# EAGLE design Vibration Sensor Schematic Rev1 (EAGLE 9.6.2)
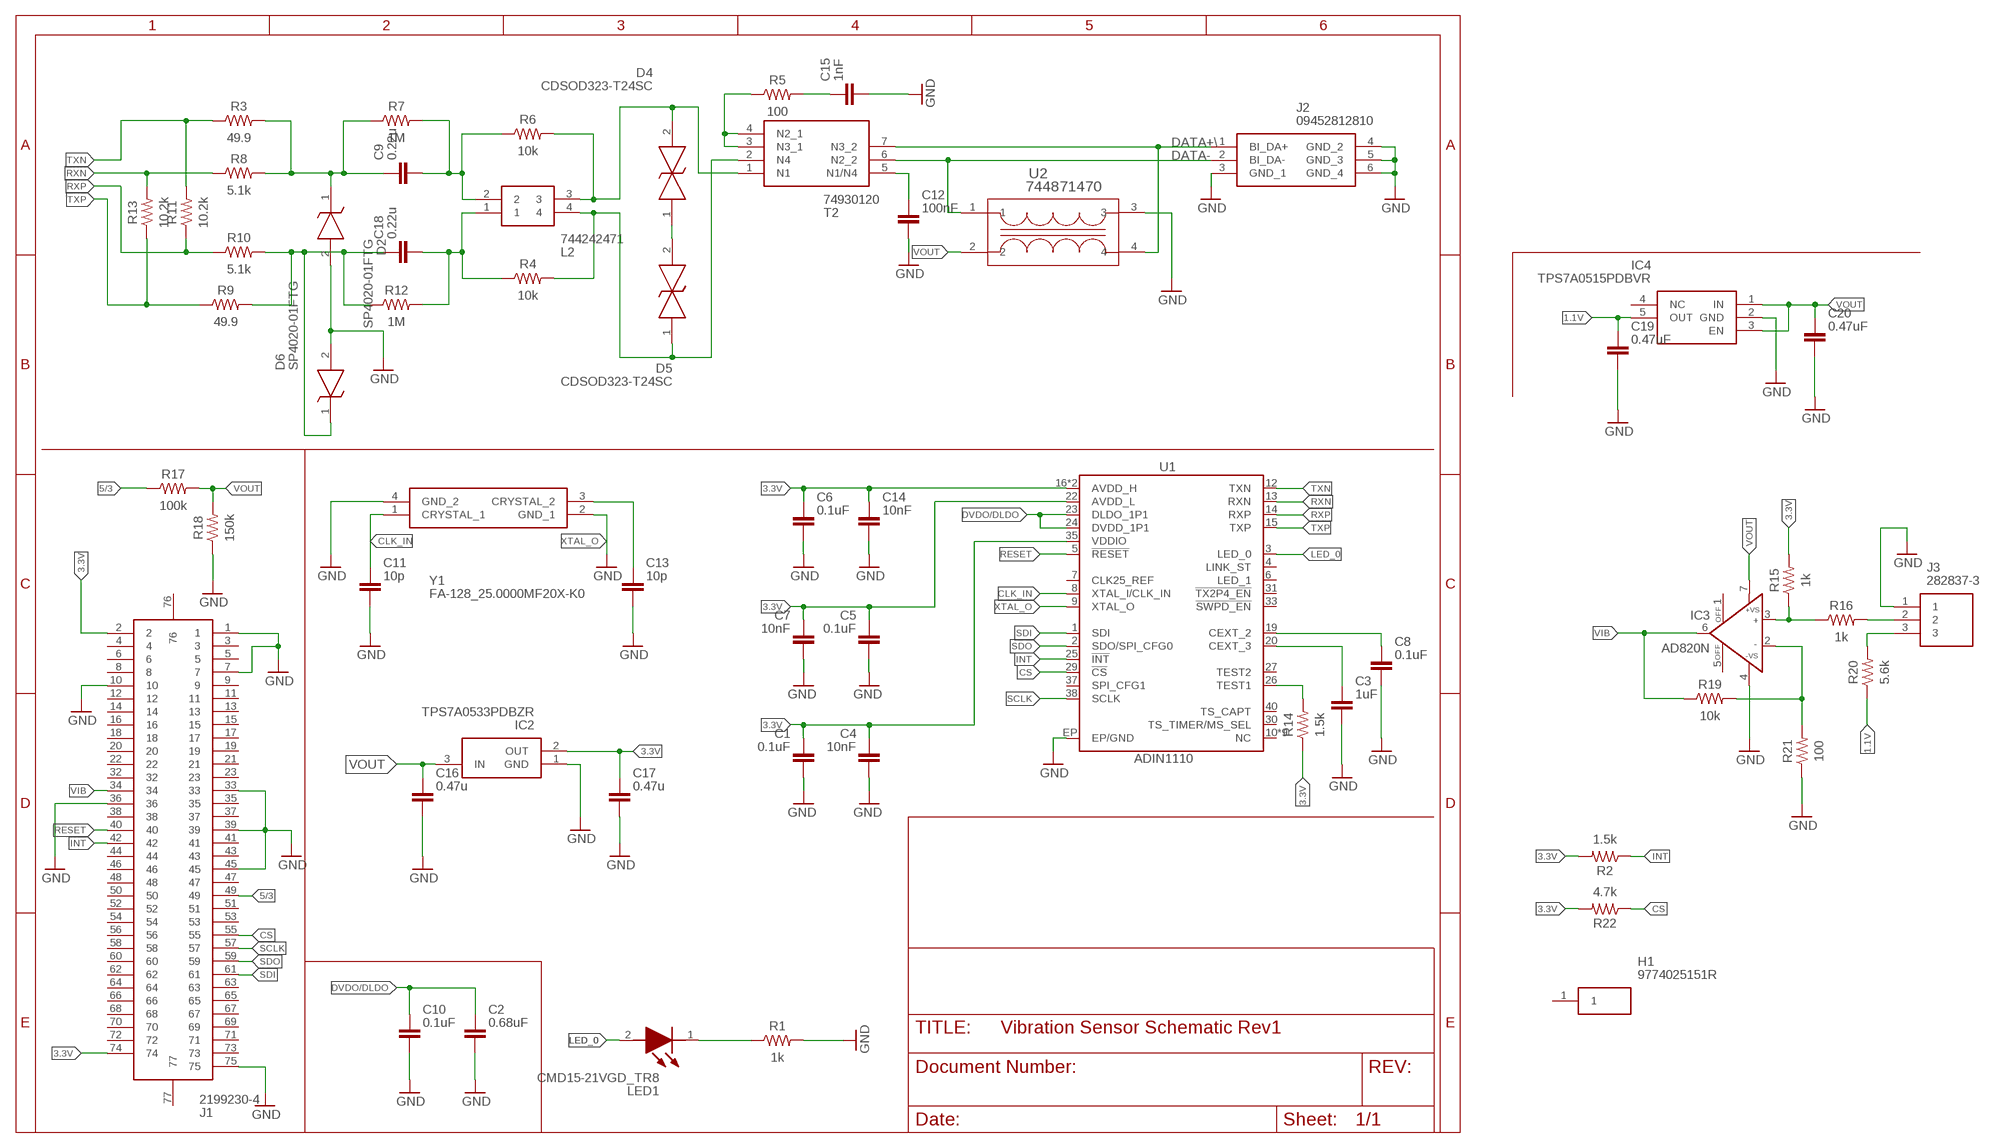
[diagram p0: schematic, sheet 1]

## Parts
C1  0.1uF  C_CHIP-0402(1005-METRIC)  [CAPC1005X60]
C2  0.68uF  C_CHIP-0402(1005-METRIC)  [CAPC1005X60]
C3  1uF  C_CHIP-0402(1005-METRIC)  [CAPC1005X60]
C4  10nF  C_CHIP-0402(1005-METRIC)  [CAPC1005X60]
C5  0.1uF  C_CHIP-0402(1005-METRIC)  [CAPC1005X60]
C6  0.1uF  C_CHIP-0402(1005-METRIC)  [CAPC1005X60]
C7  10nF  C_CHIP-0402(1005-METRIC)  [CAPC1005X60]
C8  0.1uF  C_CHIP-0402(1005-METRIC)  [CAPC1005X60]
C9  0.22u  C_CHIP-0402(1005-METRIC)  [CAPC1005X60]
C10  0.1uF  C_CHIP-0402(1005-METRIC)  [CAPC1005X60]
C11  10p  C_CHIP-0402(1005-METRIC)  [CAPC1005X60]
C12  100nF  C_CHIP-0402(1005-METRIC)  [CAPC1005X60]
C13  10p  C_CHIP-0402(1005-METRIC)  [CAPC1005X60]
C14  10nF  C_CHIP-0402(1005-METRIC)  [CAPC1005X60]
C15  1nF  C_CHIP-0402(1005-METRIC)  [CAPC1005X60]
C16  0.47u  C_CHIP-0402(1005-METRIC)  [CAPC1005X60]
C17  0.47u  C_CHIP-0402(1005-METRIC)  [CAPC1005X60]
C18  0.22u  C_CHIP-0402(1005-METRIC)  [CAPC1005X60]
C19  0.47uF  C_CHIP-0402(1005-METRIC)  [CAPC1005X60]
C20  0.47uF  C_CHIP-0402(1005-METRIC)  [CAPC1005X60]
D2  SP4020-01FTG  [SOD2613X114N]
D4  CDSOD323-T24SC  [SOD2513X114N]
D5  CDSOD323-T24SC  [SOD2513X114N]
D6  SP4020-01FTG  [SOD2613X114N]
H1  9774025151R  [9774025151R]
IC2  TPS7A0533PDBZR  [SOT95P237X112-3N]
IC3  AD820N  [DIL08]
IC4  TPS7A0515PDBVR  [SOT95P280X145-5N]
J1  2199230-4  [21992304]
J2  09452812810  [09452812810]
J3  282837-3  [2828373]
L2  744242471  [744242471]
LED1  CMD15-21VGD_TR8  [LEDC3215X130N]
R1  1k  R-US_CHIP-0402(1005-METRIC)  [RESC1005X40]
R2  1.5k  R-US_CHIP-0402(1005-METRIC)  [RESC1005X40]
R3  49.9  R-US_CHIP-0402(1005-METRIC)  [RESC1005X40]
R4  10k  R-US_CHIP-0402(1005-METRIC)  [RESC1005X40]
R5  100  R-US_CHIP-0402(1005-METRIC)  [RESC1005X40]
R6  10k  R-US_CHIP-0402(1005-METRIC)  [RESC1005X40]
R7  1M  R-US_CHIP-0402(1005-METRIC)  [RESC1005X40]
R8  5.1k  R-US_CHIP-0402(1005-METRIC)  [RESC1005X40]
R9  49.9  R-US_CHIP-0402(1005-METRIC)  [RESC1005X40]
R10  5.1k  R-US_CHIP-0402(1005-METRIC)  [RESC1005X40]
R11  10.2k  R-US_CHIP-0402(1005-METRIC)  [RESC1005X40]
R12  1M  R-US_CHIP-0402(1005-METRIC)  [RESC1005X40]
R13  10.2k  R-US_CHIP-0402(1005-METRIC)  [RESC1005X40]
R14  1.5k  R-US_CHIP-0402(1005-METRIC)  [RESC1005X40]
R15  1k  R-US_CHIP-0402(1005-METRIC)  [RESC1005X40]
R16  1k  R-US_CHIP-0402(1005-METRIC)  [RESC1005X40]
R17  100k  R-US_CHIP-0402(1005-METRIC)  [RESC1005X40]
R18  150k  R-US_CHIP-0402(1005-METRIC)  [RESC1005X40]
R19  10k  R-US_CHIP-0402(1005-METRIC)  [RESC1005X40]
R20  5.6k  R-US_CHIP-0402(1005-METRIC)  [RESC1005X40]
R21  100  R-US_CHIP-0402(1005-METRIC)  [RESC1005X40]
R22  4.7k  R-US_CHIP-0402(1005-METRIC)  [RESC1005X40]
T2  74930120  [74930120]
U1  ADIN1110  [LFCSP-40]
U2  744871470  [SMT_871470_WRE]
Y1  FA-128_25.0000MF20X-K0  [FA128250000MF20XK0]

## Nets
1.1V: C19.1 IC4.5(OUT) R20.1
3.3V: C1.1 C4.1 C5.1 C6.1 C7.1 C14.1 C17.1 IC2.2(OUT) J1.2 J1.74 R2.2 R14.1 R15.2 R22.2 U1.16(AVDD_H) U1.17(AVDD_H) U1.22(AVDD_L) U1.35(VDDIO)
5/3: J1.49 R17.1
CLK_IN: C11.1 U1.8(XTAL_I/CLK_IN) Y1.1(CRYSTAL_1)
CS: J1.55 R22.1 U1.29(!CS!)
DATA+\: J2.1(BI_DA+) T2.7(N3_2) U2.4
DATA-: J2.2(BI_DA-) T2.6(N2_2) U2.1
DVDO/DLDO: C2.1 C10.1 U1.23(DLDO_1P1) U1.24(DVDD_1P1)
GND: C1.2 C2.2 C3.2 C4.2 C5.2 C6.2 C7.2 C8.2 C10.2 C11.2 C12.2 C13.2 C14.2 C15.2 C16.2 C17.2 C19.2 C20.2 D2.2(A) D6.2(A) IC2.1(GND) IC3.4(-VS) IC4.2(GND) J1.1 J1.7 J1.10 J1.33 J1.36 J1.39 J1.45 J1.75 J2.3(GND_1) J2.4(GND_2) J2.5(GND_3) J2.6(GND_4) J3.1 R1.2 R18.1 R21.1 U1.EP(EP/GND) U2.3 Y1.2(GND_1) Y1.4(GND_2)
INT: J1.42 R2.1 U1.25(!INT!)
LED_0: LED1.2(A) U1.3(LED_0)
N$1: C15.1 R5.2
N$2: LED1.1(K) R1.1
N$3: IC3.3(IN+) R15.1 R16.1
N$4: IC3.2(IN-) R19.2 R21.2
N$5: J3.3 R20.2
N$6: J3.2 R16.2
N$16: C18.2 L2.1 R4.1 R12.2
N$18: R14.2 U1.26(TEST1)
N$19: C9.2 L2.2 R6.1 R7.2
N$20: D5.1 L2.4 R4.2 T2.2(N4)
N$21: C8.1 U1.19(CEXT_2)
N$22: C3.1 U1.20(CEXT_3)
N$24: C9.1 D2.1(K) R3.2 R7.1 R8.2
N$28: C12.1 T2.5(N1/N4)
N$30: R5.1 T2.3(N3_1) T2.4(N2_1)
N$31: C18.1 D6.1(K) R9.2 R10.2 R12.1
N$42: D4.2 L2.3 R6.2 T2.1(N1)
N$43: D4.1 D5.2
RESET: J1.40 U1.5(!RESET!)
RXN: R8.1 R13.2 U1.13(RXN)
RXP: R10.1 R11.1 U1.14(RXP)
SCLK: J1.57 U1.38(SCLK)
SDI: J1.61 U1.1(SDI)
SDO: J1.59 U1.2(SDO/SPI_CFG0)
TXN: R3.1 R11.2 U1.12(TXN)
TXP: R9.1 R13.1 U1.15(TXP)
VIB: IC3.6(OUT) J1.34 R19.1
VOUT: C16.1 C20.1 IC2.3(IN) IC3.7(+VS) IC4.1(IN) IC4.3(EN) R17.2 R18.2 U2.2
XTAL_O: C13.1 U1.9(XTAL_O) Y1.3(CRYSTAL_2)
Unconnected: H1.1 IC3.1(OFF) IC3.5(OFF) IC4.4(NC) J1.3 J1.4 J1.5 J1.6 J1.8 J1.9 J1.11 J1.12 J1.13 J1.14 J1.15 J1.16 J1.17 J1.18 J1.19 J1.20 J1.21 J1.22 J1.23 J1.32 J1.35 J1.37 J1.38 J1.41 J1.43 J1.44 J1.46 J1.47 J1.48 J1.50 J1.51 J1.52 J1.53 J1.54 J1.56 J1.58 J1.60 J1.62 J1.63 J1.64 J1.65 J1.66 J1.67 J1.68 J1.69 J1.70 J1.71 J1.72 J1.73 J1.76 J1.77 U1.4(LINK_ST) U1.6(LED_1) U1.7(CLK25_REF) U1.10(NC) U1.11(NC) U1.18(NC) U1.21(NC) U1.27(TEST2) U1.28(NC) U1.30(TS_TIMER/MS_SEL) U1.31(!TX2P4_EN!) U1.32(NC) U1.33(!SWPD_EN!) U1.34(NC) U1.36(NC) U1.37(SPI_CFG1) U1.39(NC) U1.40(TS_CAPT)

## Library data of the parts
C1-C20 = Capacitor:C: Capacitor - Generic; CATEGORY: Capacitor
D2 D6 = SamacSys_Parts:SP4020-01FTG: Littelfuse TVS Diode Array Uni-Directional, 750W Triple, 2-Pin SOD-323 SP4020-01FTG, Source: Datasheet <https://www.littelfuse.com/~/media/electronics/datasheets/tvs_diode_arrays/littelfuse_tvs_diode_array_sp4020_datasheet.pdf.pdf>; DESCRIPTION: Littelfuse TVS Diode Array Uni-Directional, 750W Triple, 2-Pin SOD-323 SP4020-01FTG,; HEIGHT: 1.14mm; MANUFACTURER_NAME: LITTELFUSE; MANUFACTURER_PART_NUMBER: SP4020-01FTG; MOUSER_PART_NUMBER: 576-SP4020-01FTG; MOUSER_PRICE-STOCK: https://www.mouser.co.uk/ProductDetail/Littelfuse/SP4020-01FTG?qs=eIdvKxokjW4Yi6Ov7kZjPg%3D%3D
D4 D5 = SamacSys_Parts:CDSOD323-T24SC: ESD Suppressors / TVS Diodes Bidirectional Std Cap Source: Datasheet <https://www.bourns.com/docs/Product-Datasheets/CDSOD323-TxxLC.pdf>; ARROW_PART_NUMBER: CDSOD323-T24SC; ARROW_PRICE-STOCK: https://www.arrow.com/en/products/cdsod323-t24sc/bourns?region=nac; DESCRIPTION: ESD Suppressors / TVS Diodes Bidirectional Std Cap; HEIGHT: 1.14mm; MANUFACTURER_NAME: Bourns; MANUFACTURER_PART_NUMBER: CDSOD323-T24SC; MOUSER_PART_NUMBER: 652-CDSOD323-T24SC; MOUSER_PRICE-STOCK: https://www.mouser.co.uk/ProductDetail/Bourns/CDSOD323-T24SC?qs=6S5Watp5UnLXKCNVDRqkmw%3D%3D
H1 = 9774025151R:9774025151R: 9774025151R, 2.5mm High Steel Round Spacer With 5.1mm Diameter and 3.5mm Bore Diameter for M2.5 Screw Source: Datasheet <https://componentsearchengine.com/Datasheets/2/9774025151R.pdf>; DESCRIPTION: 9774025151R, 2.5mm High Steel Round Spacer With 5.1mm Diameter and 3.5mm Bore Diameter for M2.5 Screw; HEIGHT: 3.9mm; MANUFACTURER_NAME: Wurth Elektronik; MANUFACTURER_PART_NUMBER: 9774025151R; MOUSER_PART_NUMBER: 710-9774025151R; MOUSER_PRICE-STOCK: https://www.mouser.co.uk/ProductDetail/Wurth-Elektronik/9774025151R?qs=KRpiEsko4Hn1l7MecUfDpA%3D%3D
IC2 = SamacSys_Parts:TPS7A0533PDBZR: 1-A, ultra-low-IQ, 200-mA low-dropout (LDO) regulator in a small-sized package Source: Datasheet <https://www.ti.com/lit/gpn/TPS7A05>; DESCRIPTION: 1-A, ultra-low-IQ, 200-mA low-dropout (LDO) regulator in a small-sized package; HEIGHT: 1.12mm; MANUFACTURER_NAME: Texas Instruments; MANUFACTURER_PART_NUMBER: TPS7A0533PDBZR; MOUSER_PART_NUMBER: 595-TPS7A0533PDBZR; MOUSER_PRICE-STOCK: https://www.mouser.co.uk/ProductDetail/Texas-Instruments/TPS7A0533PDBZR?qs=XeJtXLiO41SvDtfTV1kb9A%3D%3D
IC3 = analog-devices:AD820N: Single-Supply, Rail-to-Rail, Low Power, FET Input Op Amp Source: http://www.analog.com/static/imported-files/data_sheets/AD820.pdf; OC_FARNELL: 1438579; OC_NEWARK: unknown
IC4 = SamacSys_Parts:TPS7A0515PDBVR: 1-A, ultra-low-IQ, 200-mA low-dropout (LDO) regulator in a small-sized package Source: Datasheet <http://www.ti.com/lit/gpn/tps7a05>; ARROW_PART_NUMBER: TPS7A0515PDBVR; ARROW_PRICE-STOCK: https://www.arrow.com/en/products/tps7a0515pdbvr/texas-instruments; DESCRIPTION: 1-A, ultra-low-IQ, 200-mA low-dropout (LDO) regulator in a small-sized package; HEIGHT: 1.45mm; MANUFACTURER_NAME: Texas Instruments; MANUFACTURER_PART_NUMBER: TPS7A0515PDBVR; MOUSER_PART_NUMBER: 595-TPS7A0515PDBVR; MOUSER_PRICE-STOCK: https://www.mouser.co.uk/ProductDetail/Texas-Instruments/TPS7A0515PDBVR?qs=vdi0iO8H4N3Aseh6c469Zw%3D%3D
J1 = SamacSys_Parts:2199230-4: AMP - TE CONNECTIVITY - 2199230-4 - CONNECTOR, CARD EDGE, RCPT, 67POS, 2ROW Source: Datasheet <https://www.te.com/commerce/DocumentDelivery/DDEController?Action=srchrtrv&DocNm=2199230&DocType=Customer Drawing&DocLang=English&DocFormat=pdf&PartCntxt=2199230-4>; DESCRIPTION: AMP - TE CONNECTIVITY - 2199230-4 - CONNECTOR, CARD EDGE, RCPT, 67POS, 2ROW; HEIGHT: mm; MANUFACTURER_NAME: TE Connectivity; MANUFACTURER_PART_NUMBER: 2199230-4; MOUSER_PART_NUMBER: 571-2199230-4; MOUSER_PRICE-STOCK: https://www.mouser.co.uk/ProductDetail/TE-Connectivity/2199230-4?qs=EQCnRgr4b6HnhitEoflgGQ%3D%3D
J2 = SamacSys_Parts:09452812810: T1 Industrial Jack Connectors, PCB connector, Angled, THR connection, Rated current: 4 A, Contacts: 2, + shielding Source: Datasheet <https://b2b.harting.com/files/download/PRD/PDF_TS/09452812810_100689697DRW003M.pdf?siteName=Ebusiness Site&autoLogoutEnabled=false&autoLogoutTime=0&contextURL=https://b2b.harting.com/ebusiness/en&maintenanceAnnouncement={ }&showPrivacyEmailA>; DESCRIPTION: T1 Industrial Jack Connectors, PCB connector, Angled, THR connection, Rated current: 4 A, Contacts: 2, + shielding; HEIGHT: 6.1mm; MANUFACTURER_NAME: HARTING; MANUFACTURER_PART_NUMBER: 09452812810; MOUSER_PART_NUMBER: 617-09452812810; MOUSER_PRICE-STOCK: https://www.mouser.co.uk/ProductDetail/HARTING/09452812810?qs=IPgv5n7u5QYWjjwXDCl9%252Bw%3D%3D
J3 = SamacSys_Parts:282837-3: Fixed Terminal Blocks 5.08MM PCB MOUNT 3P Source: Datasheet <http://uk.rs-online.com/web/p/products/7100371P>; ARROW_PART_NUMBER: 282837-3; ARROW_PRICE-STOCK: https://www.arrow.com/en/products/282837-3/te-connectivity?region=nac; DESCRIPTION: Fixed Terminal Blocks 5.08MM PCB MOUNT 3P; HEIGHT: 10.3mm; MANUFACTURER_NAME: TE Connectivity; MANUFACTURER_PART_NUMBER: 282837-3; MOUSER_PART_NUMBER: 571-2828373; MOUSER_PRICE-STOCK: https://www.mouser.co.uk/ProductDetail/TE-Connectivity/282837-3?qs=A%252Bip%252BNCYi6PMRxtBYEOSrQ%3D%3D
L2 = SamacSys_Parts:744242471: WE-SLM SMD Common Mode Choke 470uH 400mA Source: Datasheet <http://katalog.we-online.com/pbs/datasheet/744242471.pdf>; DESCRIPTION: WE-SLM SMD Common Mode Choke 470uH 400mA; HEIGHT: 3mm; MANUFACTURER_NAME: Wurth Elektronik; MANUFACTURER_PART_NUMBER: 744242471; MOUSER_PART_NUMBER: 710-744242471; MOUSER_PRICE-STOCK: https://www.mouser.co.uk/ProductDetail/Wurth-Elektronik/744242471?qs=PGXP4M47uW7UIiGXUC0ZiA%3D%3D
LED1 = SamacSys_Parts:CMD15-21VGD_TR8: VCC CMD15-21VGD/TR8, CMD15-21 Series Clear LED, 570 nm,, Rectangle Lens Source: Datasheet <https://componentsearchengine.com/Datasheets/2/CMD15-21VGD_TR8.pdf>; ARROW_PART_NUMBER: CMD15-21VGD/TR8; ARROW_PRICE-STOCK: https://www.arrow.com/en/products/cmd15-21vgdtr8/visual-communications; DESCRIPTION: VCC CMD15-21VGD/TR8, CMD15-21 Series Clear LED, 570 nm,, Rectangle Lens; HEIGHT: 1.3mm; MANUFACTURER_NAME: Visual Communications Company; MANUFACTURER_PART_NUMBER: CMD15-21VGD/TR8; MOUSER_PART_NUMBER: 606-CMD15-21VGD/TR8; MOUSER_PRICE-STOCK: https://www.mouser.co.uk/ProductDetail/VCC/CMD15-21VGD-TR8?qs=rmKzSijf6EYPDoIZjcp6ew%3D%3D
R1-R22 = Resistor:R-US: Resistor Fixed - ANSI; CATEGORY: Resistor; SUB-CATEGORY: Fixed
T2 = SamacSys_Parts:74930120: WURTH ELEKTRONIK - 74930120 - Transformer, Ethernet, 1P, 10/100/1000/10G Base-T, PoE+, 1:1, Surface Mount Source: Datasheet <https://www.we-online.com/catalog/datasheet/74930120.pdf>; DESCRIPTION: WURTH ELEKTRONIK - 74930120 - Transformer, Ethernet, 1P, 10/100/1000/10G Base-T, PoE+, 1:1, Surface Mount; HEIGHT: 2.9mm; MANUFACTURER_NAME: Wurth Elektronik; MANUFACTURER_PART_NUMBER: 74930120; MOUSER_PART_NUMBER: 710-74930120; MOUSER_PRICE-STOCK: https://www.mouser.co.uk/ProductDetail/Wurth-Elektronik/74930120?qs=zW32dvEIR3sEJWqR2tCkqQ%3D%3D
U1 = ADIN1110:ADIN1110: The ADIN1110 is an ultra low power, single port, 10BASE-T1L transceiver design for industrial Ethernet applications and is compliant with the IEEE® 802.3cg-2019™ Ethernet standard for long reach, 10 Mbps single pair Ethernet (SPE).; PROD_ID: IC-16335
U2 = 744871470:744871470; COPYRIGHT: Copyright (C) 2023 Ultra Librarian. All rights reserved.; MANUFACTURER_PART_NUMBER: 744871470; MFR_NAME: Wurth Electronics
Y1 = SamacSys_Parts:FA-128_25.0000MF20X-K0: Crystals 25MHz 10PPM -40C +85C 10pF Source: Datasheet <https://support.epson.biz/td/api/doc_check.php?dl=brief_FA-128&lang=en>; DESCRIPTION: Crystals 25MHz 10PPM -40C +85C 10pF; HEIGHT: 0.5mm; MANUFACTURER_NAME: Epson Timing; MANUFACTURER_PART_NUMBER: FA-128 25.0000MF20X-K0; MOUSER_PART_NUMBER: 732-FA-12825F20X-K0; MOUSER_PRICE-STOCK: https://www.mouser.co.uk/ProductDetail/Epson-Timing/FA-128-250000MF20X-K0?qs=csoGsJbXmtBBrE23v3bRHg%3D%3D

## Board
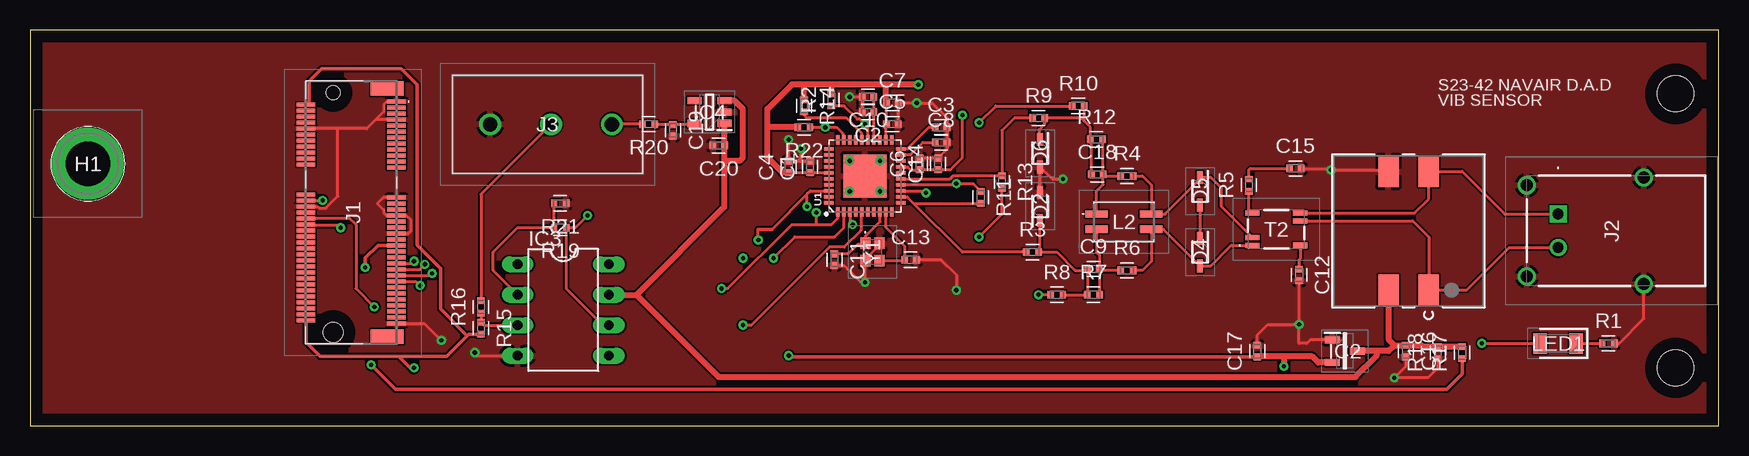
[diagram p1: board, top side]
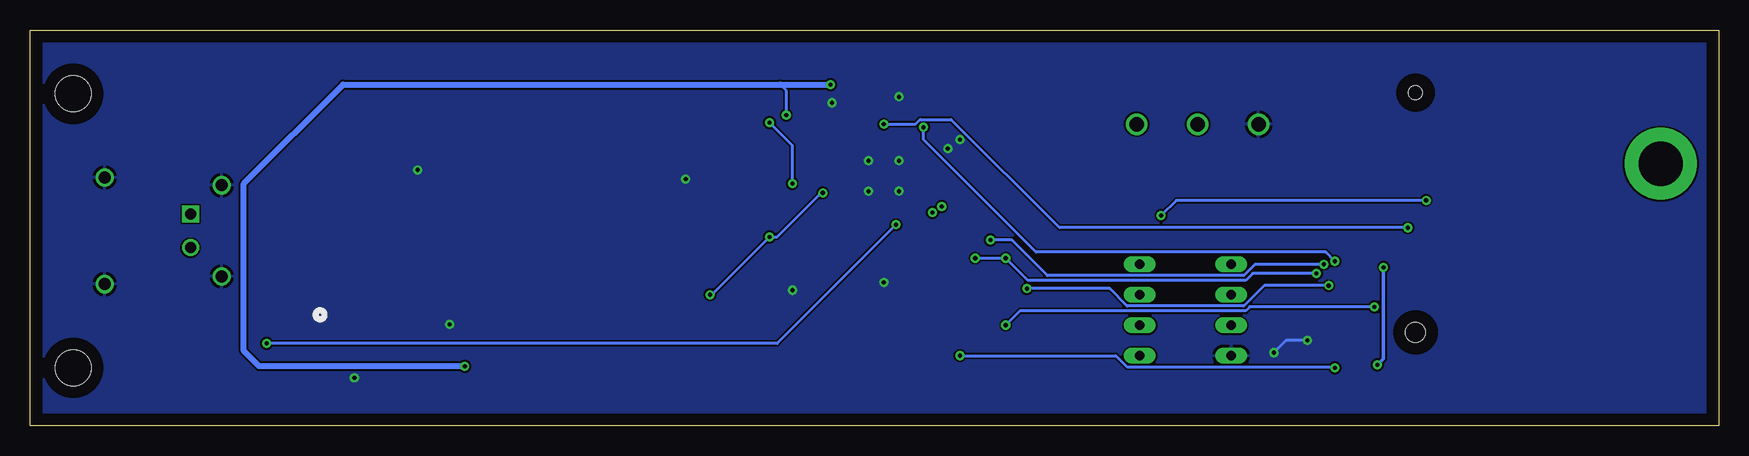
[diagram p2: board, bottom side, seen from below]

Size 140.77 x 33.01 mm. Coordinates in mm from the lower left corner, seen from the top.
Outline: 0,0 140.77,0 140.77,33.01 0,33.01 0,0
Copper layers (1*16): Top 0.035mm / dielectric 1.5mm / Bottom 0.035mm
Design rules "default": minimum track width 6mil, minimum drill 0.35mm, track to track 6mil, track to pad 6mil, pad to pad 6mil, via to via 6mil, smd to smd 6mil, copper to edge 40mil, drill to drill 6mil, minimum pad ring 10mil, minimum via ring 8mil, stop-mask expansion 4mil, vias tented up to drill 0mil, thermal gap 10mil
Holes 3 mm at 137.16,27.69 137.16,4.83

### Footprints (pad centres in the part's own frame; a part is rotated, then mirrored left to right if it is on the bottom)
CAPC1005X60 = smd 0.56 x 0.629: 1 -0.485,0; 2 0.485,0
SOD2613X114N = smd 1.075 x 0.5: 1 -1.15,0; 2 1.15,0
SOD2513X114N = smd 1.075 x 0.5: 1 -1.15,0; 2 1.15,0
9774025151R = drill 3.7 pad 6: 1 0,0
SOT95P237X112-3N = smd 1.25 x 0.6: 1 -1.05,0.95; 2 -1.05,-0.95; 3 1.05,0
DIL08 = drill 0.813 long: 1 -3.81,-3.81; 2 -1.27,-3.81; 3 1.27,-3.81; 4 3.81,-3.81; 5 3.81,3.81; 6 1.27,3.81; 7 -1.27,3.81; 8 -3.81,3.81
SOT95P280X145-5N = smd 1.2 x 0.6: 1 -1.25,0.95; 2 -1.25,0; 3 -1.25,-0.95; 4 1.25,-0.95; 5 1.25,0.95
21992304 = smd 0.3 x 1.55: 1 -9.25,3.625; 2 -9,-3.925; 3 -8.75,3.625; 4 -8.5,-3.925; 5 -8.25,3.625; 6 -8,-3.925; 7 -7.75,3.625; 8 -7.5,-3.925; 9 -7.25,3.625; 10 -7,-3.925; 11 -6.75,3.625; 12 -6.5,-3.925; 13 -6.25,3.625; 14 -6,-3.925; 15 -5.75,3.625; 16 -5.5,-3.925; 17 -5.25,3.625; 18 -5,-3.925; 19 -4.75,3.625; 20 -4.5,-3.925; 21 -4.25,3.625; 22 -4,-3.925; 23 -3.75,3.625; 32 -1.5,-3.925; 33 -1.25,3.625; 34 -1,-3.925; 35 -0.75,3.625; 36 -0.5,-3.925; 37 -0.25,3.625; 38 0,-3.925; 39 0.25,3.625; 40 0.5,-3.925; 41 0.75,3.625; 42 1,-3.925; 43 1.25,3.625; 44 1.5,-3.925; 45 1.75,3.625; 46 2,-3.925; 47 2.25,3.625; 48 2.5,-3.925; 49 2.75,3.625; 50 3,-3.925; 51 3.25,3.625; 52 3.5,-3.925; 53 3.75,3.625; 54 4,-3.925; 55 4.25,3.625; 56 4.5,-3.925; 57 4.75,3.625; 58 5,-3.925; 59 5.25,3.625; 60 5.5,-3.925; 61 5.75,3.625; 62 6,-3.925; 63 6.25,3.625; 64 6.5,-3.925; 65 6.75,3.625; 66 7,-3.925; 67 7.25,3.625; 68 7.5,-3.925; 69 7.75,3.625; 70 8,-3.925; 71 8.25,3.625; 72 8.5,-3.925; 73 8.75,3.625; 74 9,-3.925; 75 9.25,3.625 | smd 1.2 x 2.75: 76 -10.35,2.85; 77 10.35,2.85 | hole 1.15: -10,-1.65 | hole 1.65: 10,-1.65
09452812810 = drill 0.9 pad 1.4 square: 1 0,0 | drill 0.9 pad 1.4: 2 -2.8,0 | drill 1 pad 1.5: 3 -5.2,2.6; 4 2.4,2.6; 5 -5.85,-7.15; 6 3.05,-7.15
2828373 = drill 1.2 pad 1.8: 1 0,0; 2 5.08,0; 3 10.16,0
744242471 = smd 1.85 x 0.6: 1 -2.275,0.635; 2 -2.275,-0.635; 3 2.275,-0.635; 4 2.275,0.635
LEDC3215X130N = smd 1.15 x 1.7: 1 -1.5,0; 2 1.5,0
RESC1005X40 = smd 0.535 x 0.644: 1 -0.507,0; 2 0.507,0
74930120 = smd 1.2 x 0.41: 1 -1.99,-1.35; 2 -1.99,-0.7; 6 1.99,0.7; 7 1.99,1.35 | smd 0.6 x 0.41: 3 -2.29,1.35; 4 -1.69,1.35 | smd 1.2 x 0.5: 5 1.99,-1.35
LFCSP-40 = smd 0.8 x 0.285: 1 -3,2.25; 2 -3,1.75; 3 -3,1.25; 4 -3,0.75; 5 -3,0.25; 6 -3,-0.25; 7 -3,-0.75; 8 -3,-1.25; 9 -3,-1.75; 10 -3,-2.25; 21 3,-2.25; 22 3,-1.75; 23 3,-1.25; 24 3,-0.75; 25 3,-0.25; 26 3,0.25; 27 3,0.75; 28 3,1.25; 29 3,1.75; 30 3,2.25 | smd 0.285 x 0.8: 11 -2.25,-3; 12 -1.75,-3; 13 -1.25,-3; 14 -0.75,-3; 15 -0.25,-3; 16 0.25,-3; 17 0.75,-3; 18 1.25,-3; 19 1.75,-3; 20 2.25,-3; 31 2.25,3; 32 1.75,3; 33 1.25,3; 34 0.75,3; 35 0.25,3; 36 -0.25,3; 37 -0.75,3; 38 -1.25,3; 39 -1.75,3; 40 -2.25,3 | smd 3.6 x 3.6: EP 0,0
SMT_871470_WRE = smd 2.591 x 1.702: 1 0,0; 2 0,3.35; 3 9.9,3.35; 4 9.9,0
FA128250000MF20XK0 = smd 0.95 x 0.85: 1 -0.725,-0.575; 2 0.725,-0.575; 3 0.725,0.575; 4 -0.725,0.575

### Placement (x,y rotation side)
C1  65.02,21.59 90 top
C2  69.85,26.16 180 top
C3  75.95,24.89 0 top
C4  63.25,21.59 90 top
C5  71.88,25.15 0 top
C6  74.17,21.84 90 top
C7  71.88,26.92 0 top
C8  75.95,23.62 0 top
C9  88.65,13.08 0 top
C10  69.85,27.43 180 top
C11  67.06,13.84 270 top
C12  105.79,12.57 270 top
C13  73.41,13.84 0 top
C14  75.69,21.84 90 top
C15  105.47,21.46 0 top
C16  114.68,6.22 270 top
C17  102.3,6.22 90 top
C18  88.96,20.95 0 top
C19  53.59,24.64 270 top
C20  57.4,23.37 180 top
D2  84.2,18.29 90 top
D4  97.54,14.48 270 top
D5  97.54,19.56 270 top
D6  84.2,22.73 270 top
H1  4.83,21.84 0 top
IC2  109.6,6.22 0 top
IC3  44.45,9.65 270 top
IC4  56.64,26.16 180 top
J1  26.92,17.78 270 top
J2  127.38,17.65 90 top
J3  38.35,25.15 0 top
L2  91.19,17.02 0 top
LED1  127.38,6.86 180 top
R1  131.57,6.86 0 top
R2  66.8,27.18 90 top
R3  83.57,14.48 0 top
R4  91.44,20.83 0 top
R5  101.6,20.07 90 top
R6  91.44,12.95 0 top
R7  88.65,10.92 0 top
R8  85.6,10.92 0 top
R9  84.07,25.65 0 top
R10  87.38,26.67 0 top
R11  79.25,19.05 270 top
R12  88.9,23.88 0 top
R13  81.03,20.32 270 top
R14  64.52,26.67 270 top
R15  37.59,8.13 270 top
R16  37.59,9.91 90 top
R17  119.38,6.1 90 top
R18  117.35,6.1 90 top
R19  44.2,16.51 180 top
R20  51.56,25.15 180 top
R21  44.2,18.54 180 top
R22  64.52,24.89 180 top
T2  103.89,16.38 0 top
U1  69.6,20.83 90 top
U2  116.59,11.3 90 top
Y1  70.23,14.48 270 top

### Tracks (layer width: path | path; a pad name or v marks a point on that pad's centre or on a via)
1.1V
  Top 0.254: IC4.5 55.3,25.12 C19.1 52.09,25.12 R20.1
3.3V  (via drill 0.35)
  Top 0.254: U1.16 U1.17 73.16,21.58 73.41,21.34 74.14,21.34 C6.1 C14.1 76.73,21.36 77.72,22.35 v77.72,25.91 | U1.22 71.35,25.09 C5.1 C7.1 | C4.1 C1.1 66.57,21.11 U1.35
  Top 0.305: J1.2 23.28,27.06 23.28,28.76 24.3,29.78 30.93,29.78 32.26,28.45 32.26,15.08 34.21,13.13 34.21,9.73 36.45,7.49 | C17.1 63.35,5.74 v63.25,5.84 | J1.74 23.03,8.75 23.03,6.95 24.19,5.79 30.73,5.79 | R15.2 36.58,7.62 36.45,7.49 | 36.45,7.49 34.74,5.79 30.73,5.79 | v32,4.83 31.7,4.83 30.73,5.79
  Top 0.508: IC2.2 107.38,5.27 106.89,5.76 104.52,5.76 | 104.52,5.76 v104.52,4.95 | 104.52,5.76 102.32,5.76 C17.1 | v74.04,28.45 71.37,28.45 | 71.37,28.45 66.8,28.45 | 66.8,28.45 64.52,28.45 | 64.52,28.45 63.5,28.45 61.47,26.42 61.47,24.89 | R14.1 64.52,28.45 | C7.1 71.37,26.95 71.37,28.45 | C4.1 62.72,21.11 61.47,22.35 61.47,24.89 | R2.2 66.8,28.45 | R22.2 61.47,24.89
  Bottom 0.254: v77.72,25.91 77.72,27.94 78.23,28.45 | v63.25,5.84 50.25,5.84 49.31,4.9 32.08,4.9 v32,4.83
  Bottom 0.508: v104.52,4.95 121.67,4.95 122.94,6.22 122.94,20.19 114.68,28.45 78.23,28.45 v74.04,28.45
5/3  (via drill 0.35)
  Top 0.305: R17.1 119.38,4.32 118.11,3.05 30.48,3.05 v28.45,5.08 | v27.94,13.21 27.94,13.97 29,15.03 J1.49
  Bottom 0.305: v28.45,5.08 27.94,5.59 v27.94,13.21
CLK_IN
  Top 0.254: U1.8 70.87,17.81 70.87,17.02 69.66,15.81 Y1.1 69.57,15.11 68.96,15.11 68.18,14.33 C11.1
CS  (via drill 0.35)
  Top 0.254: U1.29 67.77,23.91 67.77,24.34 67.22,24.89 v66.29,24.89 R22.1 | J1.55 31.82,13.53 v32,13.72
  Bottom 0.254: v66.29,24.89 66.29,23.88 56.9,14.48 32.77,14.48 v32,13.72
DATA+\
  Top 0.254: J2.1 122.94,17.65 119.39,21.2 U2.4 116.59,18.92 115.4,17.73 T2.7
DATA-
  Top 0.254: J2.2 123.31,14.85 119.76,11.3 U2.1 116.59,15.75 115.25,17.08 T2.6
DVDO/DLDO
  Top 0.254: U1.23 U1.24 70.35,26.15 C2.1 C10.1
GND  (via drill 0.35)
  Top 0.254: v77.22,11.3 77.22,12.57 75.95,13.84 C13.2 | 69.66,13.27 Y1.2 | Y1.2 70.1,14.2 70.1,14.34 70.81,15.05 Y1.4 | Y1.2 69.6,13.69 v69.6,11.94 69.28,11.94 67.86,13.36 C11.2 | v105.79,8.45 105.79,6.86 106.43,6.86 106.74,7.17 IC2.1 | J2.5 134.53,8.93 132.46,6.86 R1.2 | U1.EP v68.33,19.56 | C12.2 v105.79,8.45 | C16.2 114.68,4.95 v113.73,4 | C17.2 102.3,7.56 103.19,8.45 v105.79,8.45 | R18.1 117.35,4.83 116.52,4 v113.73,4 | C15.2 108.33,21.46 v108.46,21.34 113.1,21.34 U2.3 | C5.2 C7.2 v73.91,26.92 75.18,26.92 76.43,25.68 C3.2 C8.2 76.43,23.07 C14.2 C6.2 | D2.2 D6.2 85.21,20.57 v86.11,20.57 | C10.2 69.34,27.43 | C1.2 64.01,22.07 C4.2 v63.25,23.88 | J1.75 32.87,8.53 v34.29,7.11 | v37.08,6.1 37.34,5.84 IC3.4 | J1.45 31.52,16.03 31.75,16.26 31.75,17.15 31.37,17.53 J1.39 29.73,17.53 29.5,17.76 29.5,18 28.96,18.54 29.44,19.03 J1.33 | J1.7 28.83,25.53 | 25.65,24.78 28.08,24.78 28.83,25.53 | 25.65,24.78 J1.10 | 28.83,25.53 29.5,26.19 29.5,26.8 29.73,27.03 J1.1 | J1.36 23.97,18.28 24.11,18.14 24.66,18.14 25.65,19.14 25.65,24.78 | v68.33,27.43 C10.2 | C10.2 C2.2
  Top 0.305: v64.26,23.11 64.26,22.33 64.01,22.07
  Bottom 0.254: v34.29,7.11 36.07,7.11 v37.08,6.1
  other vias: 68.33,22.1 70.87,22.1 70.87,19.56
  pour Bottom: 0,0 0,33.02 144.27,33.02 144.27,0
  pour Top: 0,0 0,33.02 144.27,33.02 144.27,0
INT  (via drill 0.35)
  Top 0.254: U1.25 69.85,24.9 v69.6,25.15 69.17,25.57 68.97,25.57 67.87,26.67 R2.1 | J1.42 23.07,16.71 25.71,16.71 v25.91,16.51
  Bottom 0.254: v69.6,25.15 66.97,25.15 66.57,25.55 63.99,25.55 54.95,16.51 v25.91,16.51
LED_0  (via drill 0.35)
  Top 0.254: v121.03,6.86 LED1.2 | U1.3 68.35,17 v68.58,16.76
  Bottom 0.254: v68.58,16.76 78.49,6.86 v121.03,6.86
N$1
  Top 0.254: R5.2 101.6,21.34 101.73,21.46 C15.1
N$2
  Top 0.254: LED1.1 R1.1
N$3
  Top 0.254: R16.1 R15.1 37.85,8.38 IC3.3
N$4
  Top 0.254: IC3.2 38.61,12.95 38.61,14.48 40.64,16.51 R19.2 R21.2
N$5
  Top 0.254: R20.2 J3.3
N$6
  Top 0.254: J3.2 37.59,19.3 R16.2
N$16
  Top 0.254: L2.1 88.91,19.57 89.45,20.11 C18.2 | C18.2 89.58,20.83 R4.1 | C18.2 89.45,23.84 R12.2
N$18
  Top 0.254: U1.26 69.34,24.38 68.07,25.65 64.77,25.65 64.52,25.91 R14.2
N$19
  Top 0.254: R6.1 89.26,12.95 C9.2 | C9.2 89.15,13.06 R7.2 | L2.2 88.91,14.47 89.15,14.22 89.15,13.1 C9.2
N$20
  Top 0.254: R4.2 92.71,20.83 93.46,20.08 L2.4 94.61,17.65 97.54,20.57 D5.1 98.42,20.71 99.31,19.81 99.31,18.27 T2.2
N$21
  Top 0.254: U1.19 72.62,22.61 73.41,22.61 74.42,23.62 C8.1
N$22
  Top 0.254: U1.20 72.63,23.11 73.15,23.11 74.93,24.89 C3.1
N$24
  Top 0.254: R8.2 R7.1 88.14,13.06 C9.1 88.03,12.95 87.12,12.95 85.6,14.48 R3.2 84.2,14.61 D2.1
N$28
  Top 0.254: T2.5 105.88,13.93 105.79,13.84 C12.1
N$30
  Top 0.254: R5.1 T2.3 T2.4
N$31
  Top 0.254: C18.1 88.48,23.79 R12.1 88.39,24.89 87.88,25.4 | 87.88,25.4 R10.2 | 87.88,25.4 87.63,25.65 R9.2 84.58,25.14 84.14,24.7 84.14,23.94 D6.1
N$42
  Top 0.254: R6.2 92.71,12.95 93.46,13.71 L2.3 94.48,16.38 D4.2 98.42,13.33 100.12,15.03 T2.1
N$43
  Top 0.254: D5.2 D4.1
RESET  (via drill 0.35)
  Top 0.254: U1.5 69.27,17.75 69.27,16.3 67.86,14.89 66.63,14.89 60.12,8.38 v59.44,8.38 | v28.7,9.91 27.18,11.43 27.18,16.76 26.66,17.28 J1.40
  Bottom 0.254: v28.7,9.91 39.09,9.91 39.42,9.58 58.24,9.58 v59.44,8.38
RXN  (via drill 0.35)
  Top 0.254: v74.68,19.42 74.52,19.58 U1.13 | R8.1 v84.07,10.92 | v79.12,15.75 81.03,17.65 R13.2
  Bottom 0.254: v74.68,19.42 74.68,19.56 78.49,15.75 v79.12,15.75 83.95,10.92 v84.07,10.92
RXP  (via drill 0.35)
  Top 0.254: U1.14 77.1,20.08 v77.22,20.19 78.61,20.19 R11.1 | v79.12,25.27 80.52,26.67 R10.1
  Bottom 0.254: v77.22,20.19 77.22,23.37 v79.12,25.27
SCLK  (via drill 0.35)
  Top 0.254: 64.77,19.3 65.04,19.58 U1.38 | 64.77,19.3 61.85,16.38 | v64.77,18.29 64.77,19.3 | v60.71,15.49 60.71,16.37 | J1.57 32.48,13.03 v32.91,13.46
  Top 0.305: 61.85,16.38 61.83,16.37 60.71,16.37
  Bottom 0.254: v60.71,15.49 58.93,15.49 55.96,12.52 39.59,12.52 38.65,13.46 v32.91,13.46
SDI  (via drill 0.35)
  Top 0.254: U1.1 67.31,17.79 67.31,17.27 66.8,16.76 65.53,16.76 | J1.61 32.17,12.03 v32.51,11.68 | v57.66,11.43 58.17,11.43 63.5,16.76 65.53,16.76 | v65.54,17.77 65.54,16.77 65.53,16.76
  Bottom 0.254: v32.51,11.68 37.89,11.68 39.59,9.98 49.31,9.98 50.76,11.43 v57.66,11.43
SDO  (via drill 0.35)
  Top 0.254: U1.2 67.85,16.54 67.06,15.75 63.75,15.75 v61.98,13.97 | J1.59 33.36,12.53 v33.53,12.7
  Bottom 0.254: v61.98,13.97 v59.44,13.97 57.58,12.12 39.42,12.12 38.84,12.7 v33.53,12.7
TXN
  Top 0.254: U1.12 73.12,19.08 73.66,18.54 | 73.66,18.54 R11.2 | R3.1 77.72,14.48 73.66,18.54
TXP
  Top 0.254: 81,20.85 76.94,20.85 76.67,20.58 U1.15 | 81,20.85 R13.1 | R9.1 82.04,25.65 81,24.61 81,20.85
VIB  (via drill 0.35)
  Top 0.254: J1.34 23.02,18.8 v24.38,18.8 | IC3.6 47.75,8.38 44.7,11.43 R19.1 45.47,16.51 v46.48,17.53
  Bottom 0.254: v24.38,18.8 45.21,18.8 v46.48,17.53
VOUT
  Top 0.508: U2.2 113.24,7.2 113.73,6.71 | 113.73,6.71 C16.1 115.97,6.71 116.08,6.6 R18.2 R17.2 | 113.73,6.71 113.24,6.22 112.27,6.22 | 112.27,6.22 IC2.3 | 112.27,6.22 112.27,5.84 110.49,4.06 57.4,4.06 50.55,10.92 | IC3.7 50.55,10.92 | 50.55,10.92 57.89,18.27 57.89,22.1 | 57.89,22.1 C20.1 IC4.1 | 57.89,22.1 59.18,22.1 59.44,22.35 59.44,26.42 58.74,27.11 IC4.3
XTAL_O
  Top 0.254: Y1.3 72.83,13.75 C13.1 72.92,14.96 71.35,16.54 U1.9

### Text on the board
tPlace: S23-42 NAVAIR D.A.D | VIB SENSOR